# EAGLE design 6digit-ADC-display (EAGLE 9.6.2)
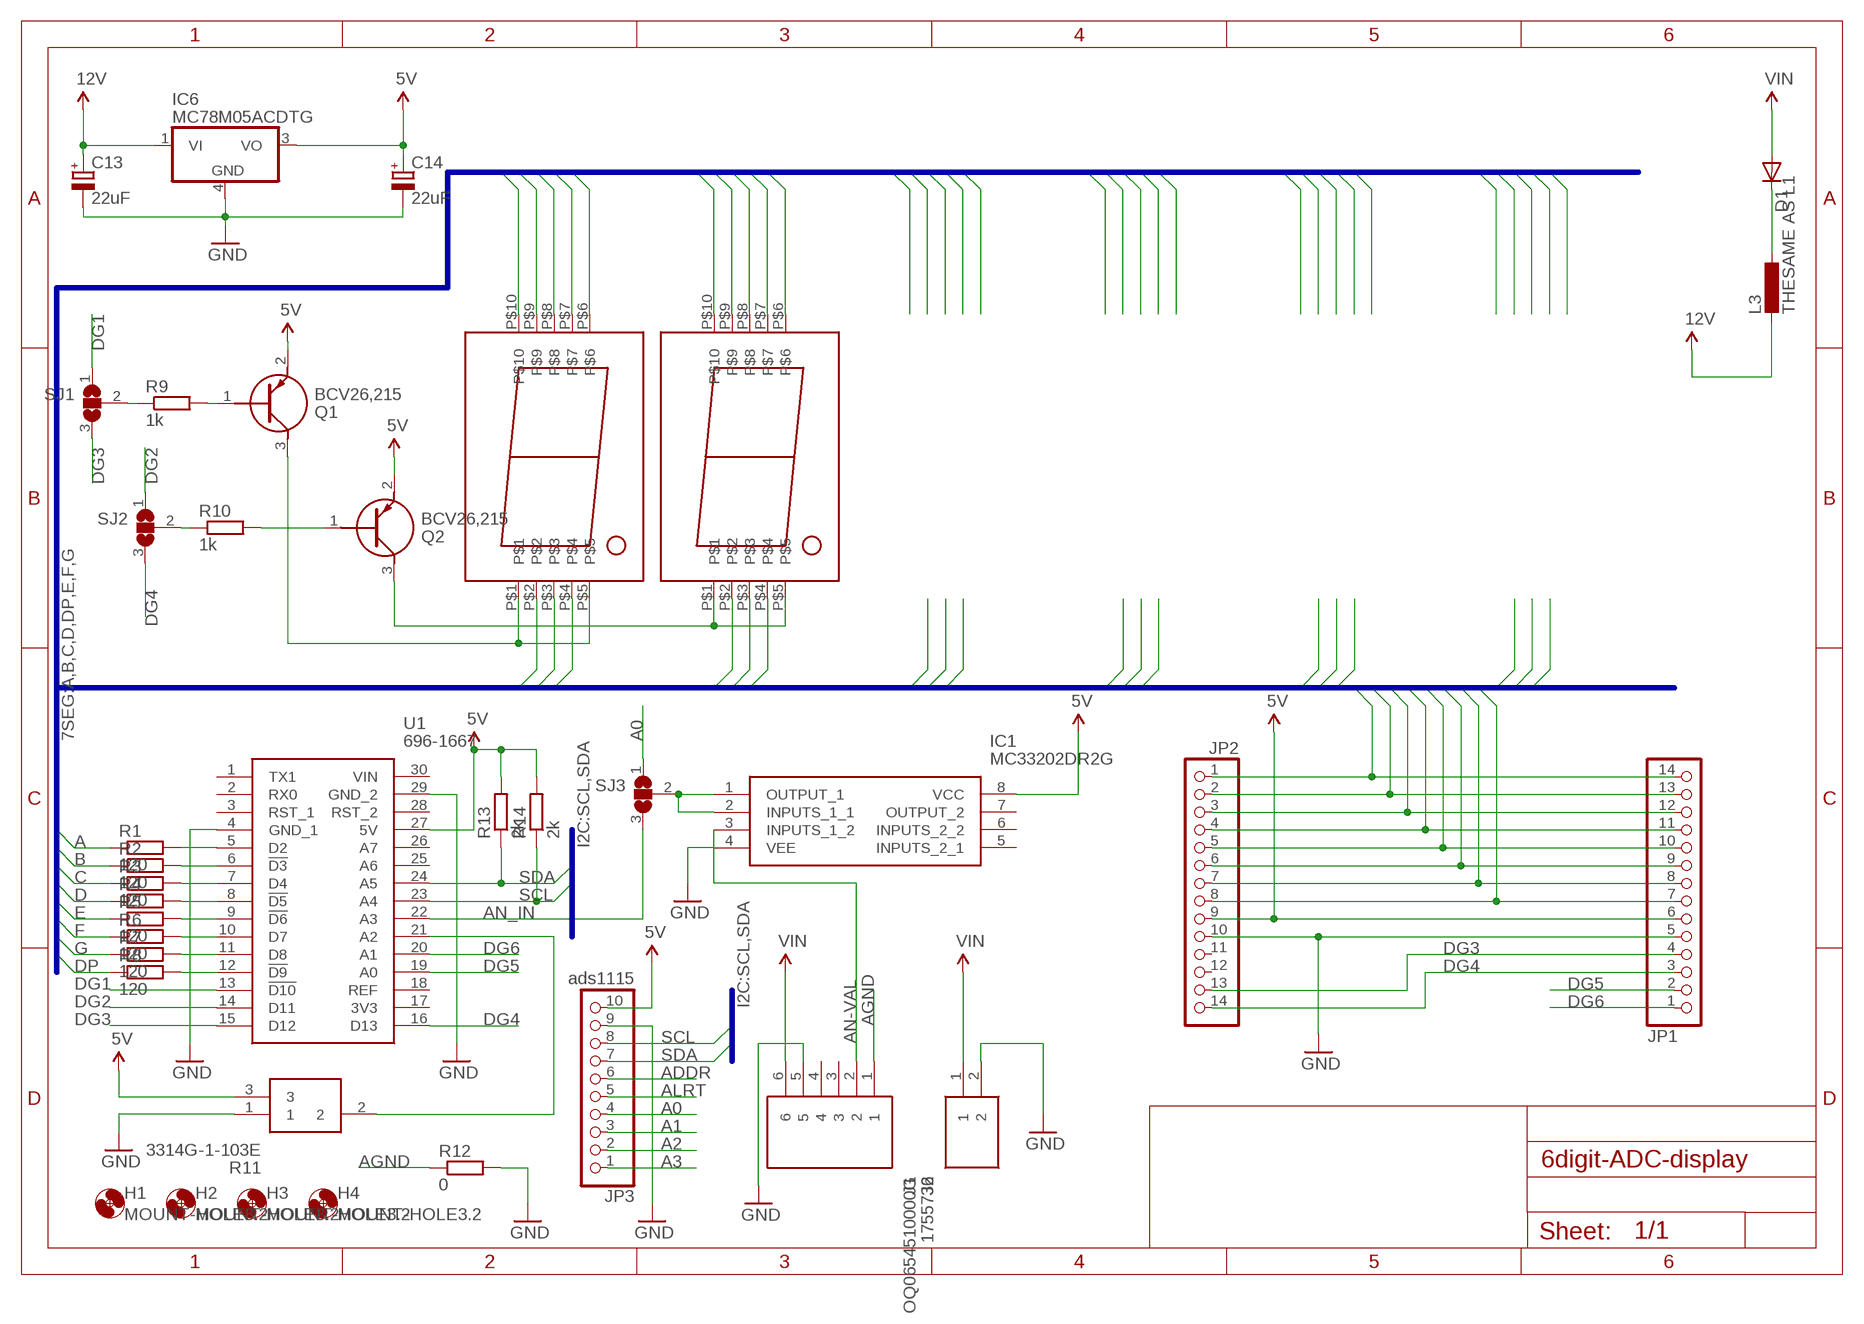
[diagram p0: schematic, sheet 1]

## Parts
C13  22uF  CPOL-EUE2.5-7  [E2,5-7]
C14  22uF  CPOL-EUE2.5-7  [E2,5-7]
D1  DIODE-DO-214AC  [DO-214AC]
H1  MOUNT-HOLE3.2  [3,2]
H2  MOUNT-HOLE3.2  [3,2]
H3  MOUNT-HOLE3.2  [3,2]
H4  MOUNT-HOLE3.2  [3,2]
IC1  MC33202DR2G  [SOIC127P600X175-8N]
IC6  MC78M05ACDTG  [DPACK_3]
J1  1755736  [SHDR2W100P0X508_1X2_1216X860X1]
J2  OQ0654510000G  [SHDRRA6W100P0X508_1X6_3248X120]
JP1  PINHD-1X14/90  [1X14/90]
JP2  PINHD-1X14/90  [1X14/90]
JP3  ads1115  PINHD-1X10  [1X10]
L3  THESAME AS L1  L-EUL1812  [L1812]
Q1  BCV26,215  [SOT95P230X110-3N]
Q2  BCV26,215  [SOT95P230X110-3N]
R1  120  R-EU_R0805  [R0805]
R2  120  R-EU_R0805  [R0805]
R3  120  R-EU_R0805  [R0805]
R4  R-EU_R0805  [R0805]
R5  120  R-EU_R0805  [R0805]
R6  120  R-EU_R0805  [R0805]
R7  120  R-EU_R0805  [R0805]
R8  120  R-EU_R0805  [R0805]
R9  1k  R-EU_R0805  [R0805]
R10  1k  R-EU_R0805  [R0805]
R11  3314G-1-103E  [3314G-1-102E]
R12  0  R-EU_R0805  [R0805]
R13  2k  R-EU_R0805  [R0805]
R14  2k  R-EU_R0805  [R0805]
SJ1  SJ2W  [SJ_2]
SJ2  SJ2W  [SJ_2]
SJ3  SJ2W  [SJ_2]
U1  696-1667  [6961667]
U$1  TOS-23101BMRL-B  [TOS-23101BMRL-B]
U$2  TOS-23101BMRL-B  [TOS-23101BMRL-B]

## Nets
5V: C14.+ IC1.8(VCC) IC6.3(VO) JP1.6 JP2.9 JP3.10 Q1.2(E) Q2.2(E) R11.3 R13.2 R14.2 U1.27(5V)
12V: C13.+ IC6.1(VI) L3.2
A: JP1.14 JP2.1 R1.1 U$1.P$7 U$2.P$7
A0: JP3.4 SJ3.1
A1: JP3.3
A2: JP3.2
A3: JP3.1
ADDR: JP3.6
AGND: J2.1 R12.1
ALRT: JP3.5
AN-VAL: IC1.3(INPUTS_1_2) J2.2
AN_IN: SJ3.3 U1.22(A3)
B: JP1.13 JP2.2 R2.1 U$1.P$6 U$2.P$6
C: JP1.12 JP2.3 R3.1 U$1.P$4 U$2.P$4
D: JP1.11 JP2.4 R4.1 U$1.P$3 U$2.P$3
DG1: SJ1.1 U1.13(!D10)
DG2: SJ2.1 U1.14(D11)
DG3: JP1.4 JP2.13 SJ1.3 U1.15(D12)
DG4: JP1.3 JP2.14 SJ2.3 U1.16(D13)
DG5: JP1.2 U1.19(A0)
DG6: JP1.1 U1.20(A1)
DP: JP1.7 JP2.8 R8.1 U$1.P$8 U$2.P$8
E: JP1.10 JP2.5 R5.1 U$1.P$2 U$2.P$2
F: JP1.9 JP2.6 R6.1 U$1.P$9 U$2.P$9
G: JP1.8 JP2.7 R7.1 U$1.P$10 U$2.P$10
GND [strongPower]: C13.- C14.- IC1.4(VEE) IC6.4(GND) J1.2 J2.5 JP1.5 JP2.10 JP3.9 R11.1 R12.2 U1.4(GND_1) U1.29(GND_2)
N$1: R1.2 U1.5(D2)
N$2: R2.2 U1.6(!D3)
N$3: R3.2 U1.7(D4)
N$4: R4.2 U1.8(!D5)
N$5: R5.2 U1.9(!D6)
N$6: R6.2 U1.10(D7)
N$7: R7.2 U1.11(D8)
N$8: R8.2 U1.12(!D9)
N$9: D1.1(C) L3.1
N$10: Q1.1(B) R9.2
N$11: Q2.1(B) R10.2
N$12: R9.1 SJ1.2
N$13: R10.1 SJ2.2
N$14: Q1.3(C) U$1.P$1 U$1.P$5
N$15: Q2.3(C) U$2.P$1 U$2.P$5
N$16: IC1.1(OUTPUT_1) IC1.2(INPUTS_1_1) SJ3.2
N$17: R11.2 U1.21(A2)
SCL: JP3.8 R14.1 U1.23(A4)
SDA: JP3.7 R13.1 U1.24(A5)
VIN: D1.2(A) J1.1 J2.6
Unconnected: IC1.5(INPUTS_2_1) IC1.6(INPUTS_2_2) IC1.7(OUTPUT_2) J2.3 J2.4 JP2.11 JP2.12 U1.1(TX1) U1.2(RX0) U1.3(RST_1) U1.17(3V3) U1.18(REF) U1.25(A6) U1.26(A7) U1.28(RST_2) U1.30(VIN)

## Buses
7SEG:A,B,C,D,DP,E,F,G
I2C:SCL,SDA

## Library data of the parts
C13 C14 = Oconner-STM-lib:CPOL-EU: POLARIZED CAPACITOR, European symbol
D1 = Oconner-STM-lib:DIODE: Various Diode Packages
H1-H4 = holes:MOUNT-HOLE: MOUNTING HOLE with drill center marker
IC1 = SamacSys_Parts:MC33202DR2G: ON SEMICONDUCTOR - MC33202DR2G - Operational Amplifier, Rail-to-Rail, 2 Amplifier, 2.2 MHz, 1 V/s, 1.8V to 12V, SOIC, 8 Pins Source: Datasheet <https://www.onsemi.com/pub/Collateral/MC33201-D.PDF>; ARROW_PART_NUMBER: MC33202DR2G; ARROW_PRICE-STOCK: https://www.arrow.com/en/products/mc33202dr2g/on-semiconductor; DESCRIPTION: ON SEMICONDUCTOR - MC33202DR2G - Operational Amplifier, Rail-to-Rail, 2 Amplifier, 2.2 MHz, 1 V/s, 1.8V to 12V, SOIC, 8 Pins; HEIGHT: 1.75mm; MANUFACTURER_NAME: ON Semiconductor; MANUFACTURER_PART_NUMBER: MC33202DR2G; MOUSER_PART_NUMBER: 863-MC33202DR2G; MOUSER_PRICE-STOCK: https://www.mouser.co.uk/ProductDetail/ON-Semiconductor/MC33202DR2G/?qs=dFKnUM%2FquJZnGcMwnKX%2FDQ%3D%3D
IC6 = linear:MC78M: 500 mA Positive Voltage Regulators Source: Data sheet <http://www.onsemi.com/pub_link/Collateral/MC78M00-D.PDF>
J1 = FlasherV3:1755736: 2 way vertical PCB header,5.08mm pitch Phoenix Contact MSTBVA Series, 5.08mm Pitch 2 Way 1 Row Straight PCB Header, Solder Termination, 12A Source: Datasheet <http://docs-emea.rs-online.com/webdocs/135e/0900766b8135ea0b.pdf>; ARROW_PART_NUMBER: 1755736; ARROW_PRICE-STOCK: https://www.arrow.com/en/products/1755736/phoenix-contact?region=nac; DESCRIPTION: 2 way vertical PCB header,5.08mm pitch Phoenix Contact MSTBVA Series, 5.08mm Pitch 2 Way 1 Row Straight PCB Header, Solder Termination, 12A; HEIGHT: 12mm; MANUFACTURER_NAME: Phoenix Contact; MANUFACTURER_PART_NUMBER: 1755736; MOUSER_PART_NUMBER: 651-1755736; MOUSER_PRICE-STOCK: https://www.mouser.co.uk/ProductDetail/Phoenix-Contact/1755736?qs=wd%252Bw3mUqFrlo9zPE3AUt1w%3D%3D
J2 = FlasherV3:OQ0654510000G: Pluggable Terminal Blocks 508 TB SKT CLOSE RA Source: Datasheet <https://datasheet.datasheetarchive.com/originals/distributors/DKDS-9/178265.pdf>; ARROW_PART_NUMBER: OQ0654510000G; ARROW_PRICE-STOCK: https://www.arrow.com/en/products/oq0654510000g/amphenol?region=nac; DESCRIPTION: Pluggable Terminal Blocks 508 TB SKT CLOSE RA; HEIGHT: 8.5mm; MANUFACTURER_NAME: Amphenol; MANUFACTURER_PART_NUMBER: OQ0654510000G; MOUSER_PART_NUMBER: 649-OQ06545100J0G; MOUSER_PRICE-STOCK: https://www.mouser.co.uk/ProductDetail/Amphenol-Anytek/OQ0654510000G?qs=Mv7BduZupUi7WF8%2FjUbiEA%3D%3D
JP1 JP2 = pinhead:PINHD-1X14: PIN HEADER
JP3 = pinhead:PINHD-1X10: PIN HEADER
L3 = Oconner-STM-lib:L-EU: INDUCTOR, European symbol
Q1 Q2 = FlasherV3:BCV26,215: BCV26; BCV46 - PNP Darlington transistors Source: Datasheet <http://assets.nexperia.com/documents/data-sheet/BCV26_BCV46.pdf>; ARROW_PART_NUMBER: BCV26,215; ARROW_PRICE-STOCK: https://www.arrow.com/en/products/bcv26215/nexperia?region=nac; DESCRIPTION: BCV26; BCV46 - PNP Darlington transistors; HEIGHT: 1.1mm; MANUFACTURER_NAME: Nexperia; MANUFACTURER_PART_NUMBER: BCV26,215; MOUSER_PART_NUMBER: 771-BCV26215; MOUSER_PRICE-STOCK: https://www.mouser.co.uk/ProductDetail/Nexperia/BCV26215?qs=me8TqzrmIYXf7Rp2GrVrLQ%3D%3D
R1-R10 R12-R14 = rcl:R-EU_: RESISTOR, European symbol; SPICEPREFIX: R
R11 = SamacSys_Parts:3314G-1-103E: 3314G SMT top adj cermet trimmer,10K 4mm Bourns 3314G Series SMD Cermet Trimmer Resistor with Gull Wing Terminations, 10k +/-20% 0.25W +/-100ppm/C Top Adjust Source: Datasheet <https://componentsearchengine.com/Datasheets/2/3314G-1-103E.pdf>; ARROW_PART_NUMBER: 3314G-1-103E; ARROW_PRICE-STOCK: https://www.arrow.com/en/products/3314g-1-103e/bourns; DESCRIPTION: 3314G SMT top adj cermet trimmer,10K 4mm Bourns 3314G Series SMD Cermet Trimmer Resistor with Gull Wing Terminations, 10k +/-20% 0.25W +/-100ppm/C Top Adjust; HEIGHT: mm; MANUFACTURER_NAME: Bourns; MANUFACTURER_PART_NUMBER: 3314G-1-103E; MOUSER_PART_NUMBER: 652-3314G-1-103E; MOUSER_PRICE-STOCK: https://www.mouser.co.uk/ProductDetail/Bourns/3314G-1-103E/?qs=5DXzRwmrLHHE6mxfh4g4uw%3D%3D
SJ1-SJ3 = jumper:SJ2W: SMD solder JUMPER
U1 = FlasherV3:696-1667: Arduino Nano Atmel ATmega168 or ATmega328 Source: Datasheet <https://docs.rs-online.com/2cbd/0900766b80db99cb.pdf>; DESCRIPTION: Arduino Nano Atmel ATmega168 or ATmega328; HEIGHT: 4.95mm; MANUFACTURER_NAME: RS Components; MANUFACTURER_PART_NUMBER: 696-1667
U$1 U$2 = 7seg-big:TOS-23101BMRL-B

## Board
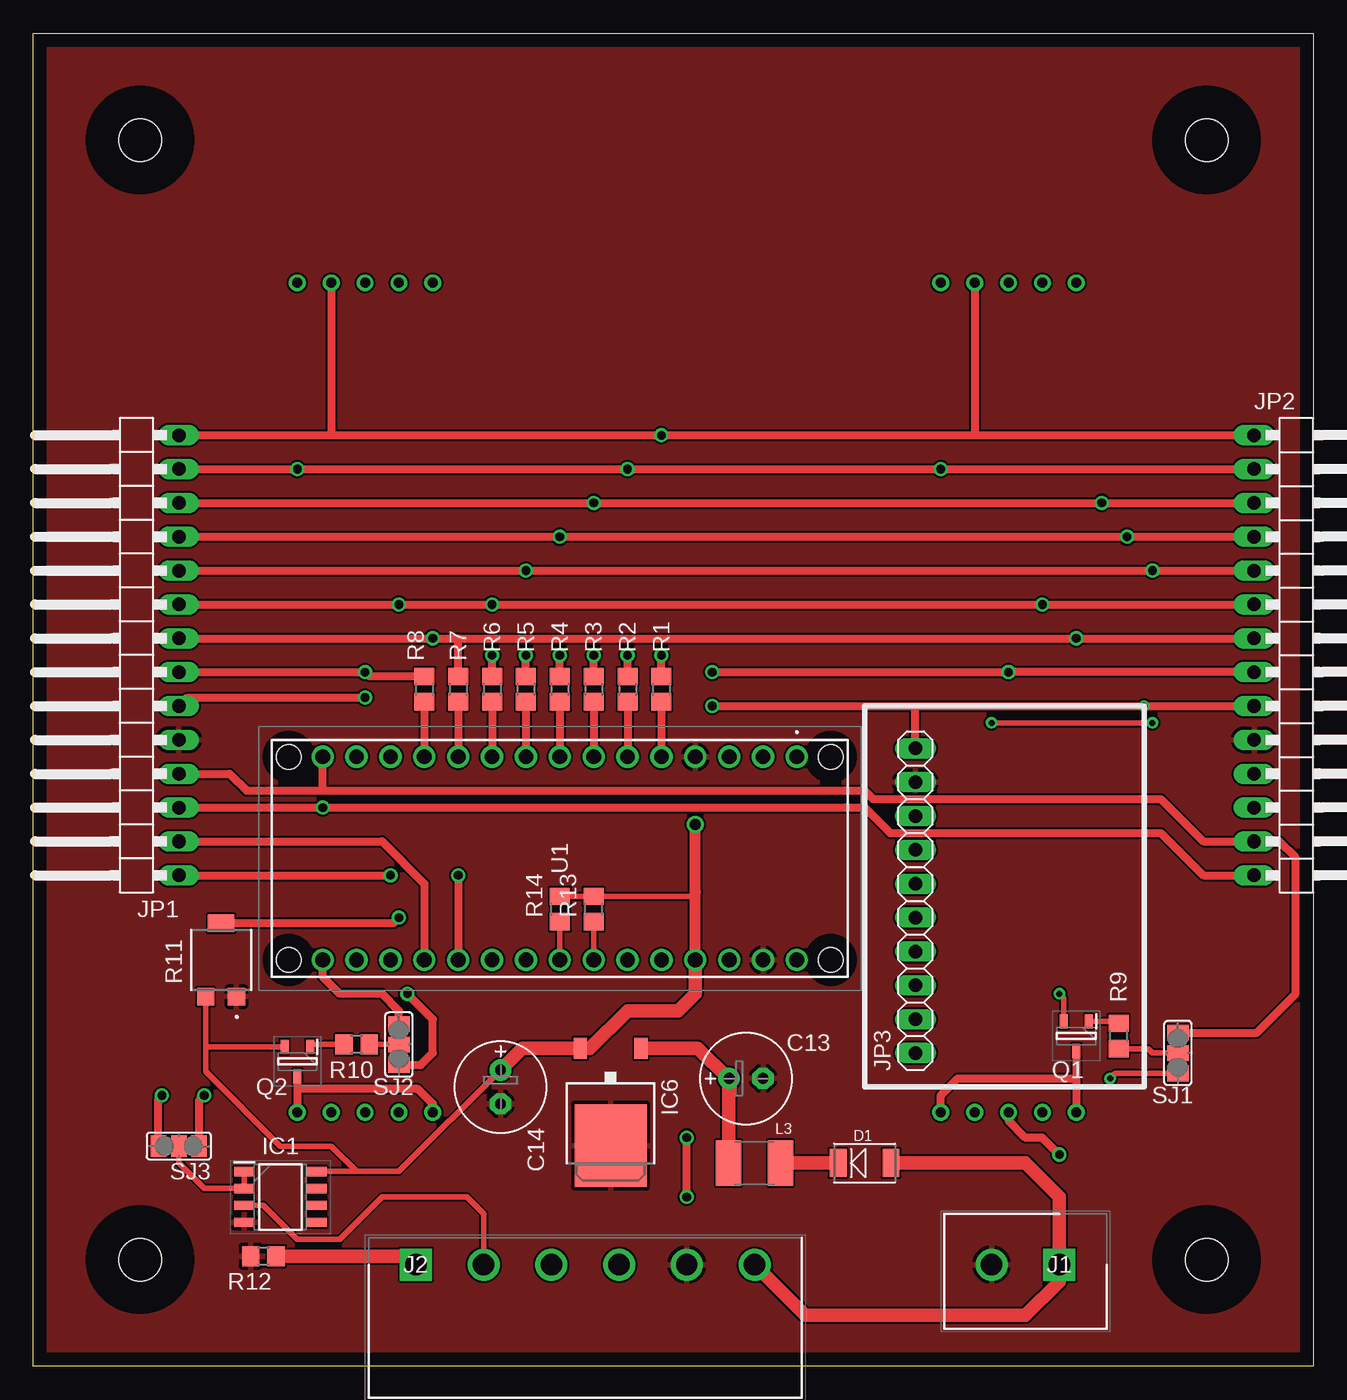
[diagram p1: board, top side]
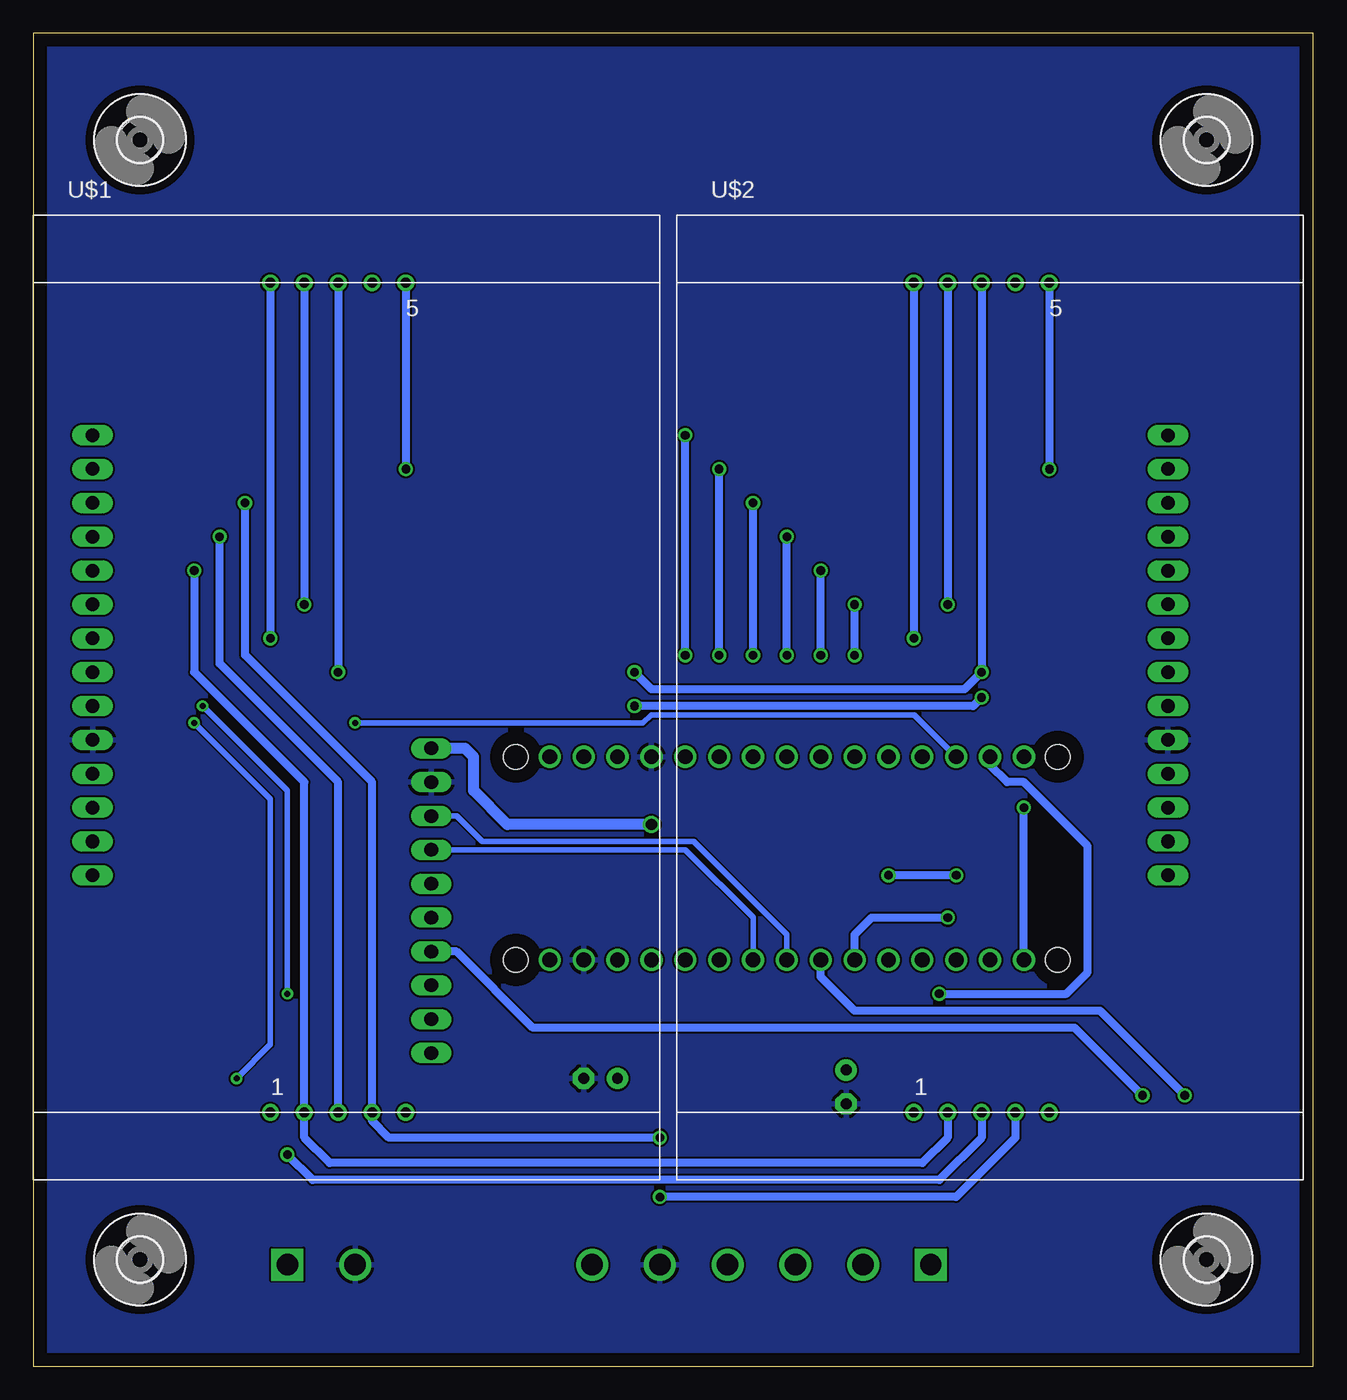
[diagram p2: board, bottom side, seen from below]

Size 96 x 100 mm. Coordinates in mm from the lower left corner, seen from the top.
Outline: 96,0 0,0 0,100 96,100 96,0
Copper layers (1*16): Top 0.035mm / dielectric 1.5mm / Bottom 0.035mm
Design rules "default": minimum track width 6mil, minimum drill 0.35mm, track to track 6mil, track to pad 6mil, pad to pad 6mil, via to via 6mil, smd to smd 6mil, copper to edge 40mil, drill to drill 6mil, minimum pad ring 10mil, minimum via ring 8mil, stop-mask expansion 4mil, vias tented up to drill 0mil, thermal gap 10mil

### Footprints (pad centres in the part's own frame; a part is rotated, then mirrored left to right if it is on the bottom)
E2,5-7 = drill 0.813 pad 1.6: + -1.27,0 | drill 0.813 pad 1.6 octagon: - 1.27,0
DO-214AC = smd 1.27 x 2.1: 1 -1.98,0; 2 1.98,0
3,2 = hole 3.2: 0,0
SOIC127P600X175-8N = smd 1.525 x 0.7: 1 -2.712,1.905; 2 -2.712,0.635; 3 -2.712,-0.635; 4 -2.712,-1.905; 5 2.712,-1.905; 6 2.712,-0.635; 7 2.712,0.635; 8 2.712,1.905
DPACK_3 = smd 1 x 1.6: 1 -2.28,-4.8; 3 2.28,-4.8 | smd 5.4 x 6.2: 4 0,2.5
SHDR2W100P0X508_1X2_1216X860X1 = drill 1.6 pad 2.4 square: 1 0,0 | drill 1.6 pad 2.4: 2 5.08,0
SHDRRA6W100P0X508_1X6_3248X120 = drill 1.6 pad 2.4 square: 1 0,0 | drill 1.6 pad 2.4: 2 -5.08,0; 3 -10.16,0; 4 -15.24,0; 5 -20.32,0; 6 -25.4,0
1X14/90 = drill 1.016 long: 1 -16.51,-3.81; 2 -13.97,-3.81; 3 -11.43,-3.81; 4 -8.89,-3.81; 5 -6.35,-3.81; 6 -3.81,-3.81; 7 -1.27,-3.81; 8 1.27,-3.81; 9 3.81,-3.81; 10 6.35,-3.81; 11 8.89,-3.81; 12 11.43,-3.81; 13 13.97,-3.81; 14 16.51,-3.81
1X10 = drill 1.016 long: 1 -11.43,0; 2 -8.89,0; 3 -6.35,0; 4 -3.81,0; 5 -1.27,0; 6 1.27,0; 7 3.81,0; 8 6.35,0; 9 8.89,0; 10 11.43,0
L1812 = smd 1.9 x 3.4: 1 -1.95,0; 2 1.95,0
SOT95P230X110-3N = smd 1.05 x 0.6: 1 -1.1,0.95; 2 -1.1,-0.95; 3 1.1,0
R0805 = smd 1.3 x 1.5: 1 -0.95,0; 2 0.95,0
3314G-1-102E = smd 1.3 x 1.3: 1 -1.15,2.75; 3 1.15,2.75 | smd 2 x 1.3: 2 0,-2.75
SJ_2 = smd 1.168 x 1.6: 1 -1.524,0; 2 0,0; 3 1.524,0
6961667 = drill 1.11 pad 1.665: 1 0,0; 2 0,-2.54; 3 0,-5.08; 4 0,-7.62; 5 0,-10.16; 6 0,-12.7; 7 0,-15.24; 8 0,-17.78; 9 0,-20.32; 10 0,-22.86; 11 0,-25.4; 12 0,-27.94; 13 0,-30.48; 14 0,-33.02; 15 0,-35.56; 16 15.24,-35.56; 17 15.24,-33.02; 18 15.24,-30.48; 19 15.24,-27.94; 20 15.24,-25.4; 21 15.24,-22.86; 22 15.24,-20.32; 23 15.24,-17.78; 24 15.24,-15.24; 25 15.24,-12.7; 26 15.24,-10.16; 27 15.24,-7.62; 28 15.24,-5.08; 29 15.24,-2.54; 30 15.24,0 | hole 1.85: 0,2.54; 0,-38.1; 15.24,-38.1; 15.24,2.54
TOS-23101BMRL-B = drill 0.75: P$1 0,0; P$2 2.54,0; P$3 5.08,0; P$4 7.62,0; P$5 10.16,0; P$6 10.16,62.23; P$7 7.62,62.23; P$8 5.08,62.23; P$9 2.54,62.23; P$10 0,62.23

### Placement (x,y rotation side)
C13  53.45,21.59 0 top
C14  35.04,20.95 270 top
D1  62.34,15.24 0 top
H1  88,8 0 bottom
H2  88,92 0 bottom
H3  8,8 0 bottom
H4  8,92 0 bottom
IC1  18.53,12.7 0 top
IC6  43.3,19.05 180 top
J1  76.95,7.62 180 top
J2  28.69,7.62 180 top
JP1  7.1,53.34 90 top
JP2  95.36,53.34 270 top
JP3  66.16,34.92 90 top
L3  54.09,15.24 180 top
Q1  78.22,24.77 270 top
Q2  19.8,22.86 270 top
R1  47.11,50.8 270 top
R2  44.56,50.8 270 top
R3  42.02,50.8 270 top
R4  39.48,50.8 270 top
R5  36.95,50.8 270 top
R6  34.41,50.8 270 top
R7  31.87,50.8 270 top
R8  29.32,50.8 270 top
R9  81.39,24.77 90 top
R10  24.25,24.13 180 top
R11  14.09,30.48 180 top
R12  17.26,8.26 180 top
R13  42.02,34.29 90 top
R14  39.48,34.29 90 top
SJ1  85.84,23.5 90 top
SJ2  27.42,24.13 90 top
SJ3  10.91,16.51 180 top
U1  57.27,45.72 270 top
U$1  78.22,19.05 0 bottom
U$2  29.96,19.05 0 bottom

### Tracks (layer width: path | path; a pad name or v marks a point on that pad's centre or on a via)
5V  (via drill 0.45, 0.65, 0.85)
  Top 0.406: R14.2 R13.2 49.33,35.24 49.65,35.56 | C14.+ 27.42,14.61 24.25,14.61 | 24.25,14.61 IC1.8 | R11.3 12.94,23.96 | 12.94,23.96 12.94,22.11 18.53,16.51 22.34,16.51 24.25,14.61 | Q2.2 12.94,23.96 | Q1.2 77.27,27.62 v76.95,27.94
  Top 0.61: JP1.6 11.54,50.16 v24.88,50.16 | v50.91,49.53 66.16,49.53 | 66.16,49.53 v83.3,49.53 JP2.9 | JP3.10 66.16,49.53
  Top 0.813: U1.27 49.65,35.56 v49.65,40.64
  Top 1.016: C14.+ 36.66,23.85 IC6.3 41.74,23.85 44.56,26.67 48.38,26.67 49.65,27.94 U1.27
  Bottom 0.406: v76.95,27.94 76.95,43.18 v83.3,49.53
  Bottom 0.61: v24.88,50.16 25.52,49.53 v50.91,49.53
  Bottom 0.813: v49.65,40.64 60.44,40.64 62.98,43.18 62.98,45.72 63.62,46.35 JP3.10
12V
  Top 1.016: L3.2 52.14,21.55 | 52.14,21.55 C13.+ | IC6.1 49.84,23.85 52.14,21.55
A  (via drill 0.65)
  Top 0.61: JP1.14 22.34,69.85 | 22.34,69.85 v47.11,69.85 70.6,69.85 | 70.6,69.85 JP2.1 | U$2.P$7 22.34,69.85 | U$1.P$7 70.6,69.85 | R1.1 v47.11,53.34
  Bottom 0.61: v47.11,53.34 v47.11,69.85
A0  (via drill 0.65)
  Top 0.61: SJ3.1 12.43,19.94 v12.82,20.32
  Bottom 0.61: v12.82,20.32 17.9,25.4 58.54,25.4 64.25,31.11 JP3.4
AGND
  Top 1.016: J2.1 28.05,8.26 R12.1
AN-VAL
  Top 0.406: IC1.3 17.26,12.06 19.8,9.53 22.98,9.53 26.15,12.7 32.5,12.7 33.77,11.43 J2.2
AN_IN  (via drill 0.65)
  Top 0.61: SJ3.3 9.39,20.07 v9.64,20.32
  Bottom 0.61: v9.64,20.32 15.99,26.67 34.41,26.67 36.95,29.21 U1.22
B  (via drill 0.65)
  Top 0.61: JP1.13 v19.8,67.31 v44.56,67.31 v68.06,67.31 JP2.2 | R2.1 v44.56,53.34
  Bottom 0.61: U$2.P$6 v19.8,67.31 | U$1.P$6 v68.06,67.31 | v44.56,53.34 v44.56,67.31
C  (via drill 0.65)
  Top 0.61: JP1.12 v42.02,64.77 v80.12,64.77 JP2.3 | R3.1 v42.02,53.34 | v49.01,12.7 v49.01,17.14
  Bottom 0.61: v42.02,53.34 v42.02,64.77 | v80.12,64.77 80.12,53.34 70.6,43.81 U$1.P$4 70.6,18.41 69.33,17.14 v49.01,17.14 | U$2.P$4 22.34,17.14 26.79,12.7 v49.01,12.7
D  (via drill 0.65)
  Top 0.61: JP1.11 v39.48,62.23 v82.03,62.23 JP2.4 | R4.1 v39.48,53.34 | v76.95,15.88 75.68,17.14 74.41,17.14 73.14,18.41 U$1.P$3
  Bottom 0.61: v39.48,53.34 v39.48,62.23 | U$1.P$3 73.14,43.81 82.03,52.7 v82.03,62.23 | U$2.P$3 24.88,17.14 28.05,13.97 75.05,13.97 v76.95,15.88
DG1  (via drill 0.45)
  Top 0.406: v71.87,48.26 v83.94,48.26 | v80.76,21.59 81.14,21.97 SJ1.1
  Bottom 0.406: U1.13 29.94,48.87 49.67,48.87 50.28,48.26 v71.87,48.26 | v83.94,48.26 78.22,42.55 78.22,24.13 v80.76,21.59
DG2  (via drill 0.65)
  Top 0.61: SJ2.1 29.07,22.61 29.96,23.5 29.96,26.04 v28.05,27.94
  Bottom 0.61: U1.14 24.25,45.09 22.98,43.81 21.7,43.81 16.92,39.03 16.92,29.84 16.92,29.55 18.53,27.94 v28.05,27.94
DG3
  Top 0.61: JP1.4 14.72,44.45 15.99,43.18 21.7,43.18 | 21.7,43.18 U1.15 | 21.7,43.18 62.34,43.18 62.98,42.55 84.57,42.55 87.75,39.37 JP2.13 93.46,39.37 94.68,38.15 94.68,27.94 91.76,25.02 SJ1.3
DG4  (via drill 0.65)
  Top 0.61: JP1.3 v21.7,41.91 62.34,41.91 64.25,40.01 84.57,40.01 87.75,36.83 JP2.14 | SJ2.3 27.42,26.67 26.15,27.94 22.98,27.94 21.7,29.21 U1.16
  Bottom 0.61: U1.16 v21.7,41.91
DG5
  Top 0.61: JP1.2 26.15,39.37 29.32,36.2 U1.19
DG6  (via drill 0.65)
  Top 0.61: JP1.1 v26.79,36.83 | v31.87,36.83 U1.20
  Bottom 0.61: v26.79,36.83 v31.87,36.83
DP  (via drill 0.65)
  Top 0.61: R8.1 25.2,51.75 v24.88,52.07 JP1.7 | JP2.8 v73.14,52.07 v50.91,52.07
  Bottom 0.61: U$1.P$8 v73.14,52.07 | U$2.P$8 v24.88,52.07 26.15,50.8 49.65,50.8 v50.91,52.07
E  (via drill 0.65)
  Top 0.61: JP1.10 v36.95,59.69 v83.94,59.69 JP2.5 | R5.1 v36.95,53.34
  Bottom 0.61: v36.95,53.34 v36.95,59.69 | v83.94,59.69 83.94,52.07 75.68,43.81 U$1.P$2 75.68,17.14 73.78,15.24 29.32,15.24 27.42,17.14 U$2.P$2
F  (via drill 0.65)
  Top 0.61: JP1.9 v27.42,57.15 v34.41,57.15 v75.68,57.15 JP2.6 | R6.1 v34.41,53.34
  Bottom 0.61: U$2.P$9 v27.42,57.15 | U$1.P$9 v75.68,57.15 | v34.41,53.34 v34.41,57.15
G  (via drill 0.65)
  Top 0.61: JP1.8 v29.96,54.61 31.87,54.61 | 31.87,54.61 v78.22,54.61 JP2.7 | R7.1 31.87,54.61
  Bottom 0.61: U$2.P$10 v29.96,54.61 | U$1.P$10 v78.22,54.61
GND
  pour Top: 0.12,99.69 0.12,0 96,0 96,99.69
  pour Bottom: 0.12,99.69 0.12,0 96,0 96,99.69
N$1
  Top 0.61: R1.2 U1.5
N$2
  Top 0.61: R2.2 U1.6
N$3
  Top 0.61: R3.2 U1.7
N$4
  Top 0.61: R4.2 U1.8
N$5
  Top 0.61: R5.2 U1.9
N$6
  Top 0.61: R6.2 U1.10
N$7
  Top 0.61: R7.2 U1.11
N$8
  Top 0.61: R8.2 U1.12
N$9
  Top 1.016: D1.1 L3.1
N$10
  Top 0.406: Q1.1 81.25,25.86 R9.2
N$11
  Top 0.406: Q2.1 20.92,24.13 R10.2
N$12
  Top 0.406: R9.1 83.61,23.82 83.94,23.5 SJ1.2
N$13
  Top 0.406: R10.1 SJ2.2
N$14
  Top 0.61: Q1.3 78.22,21.59 | 78.22,21.59 U$1.P$1 | U$1.P$5 68.06,20.32 69.33,21.59 78.22,21.59
N$15
  Top 0.61: Q2.3 19.8,20.8 | 19.8,20.8 U$2.P$5 | U$2.P$1 29.96,19.68 28.84,20.8 19.8,20.8
N$16
  Top 0.406: IC1.1 IC1.2 12.82,13.34 10.91,15.24 SJ3.2
N$17  (via drill 0.65)
  Top 0.61: v27.42,33.66 27,33.23 R11.2
  Bottom 0.61: U1.21 34.41,32.38 33.14,33.66 v27.42,33.66
SCL
  Top 0.406: U1.23 R14.1
  Bottom 0.406: U1.23 39.48,32.38 46.47,39.37 62.34,39.37 64.25,41.27 JP3.8
SDA
  Top 0.406: U1.24 R13.1
  Bottom 0.406: U1.24 42.02,33.66 47.11,38.73 JP3.7
VIN
  Top 1.016: D1.2 74.41,15.24 76.95,12.7 J1.1 76.95,6.35 74.41,3.81 57.9,3.81 J2.6